# Altium schematic sheet PSU - BUCK, LDO, CHARGER.SchDoc
size A; SheetNumber: 3; SheetTotal: 3
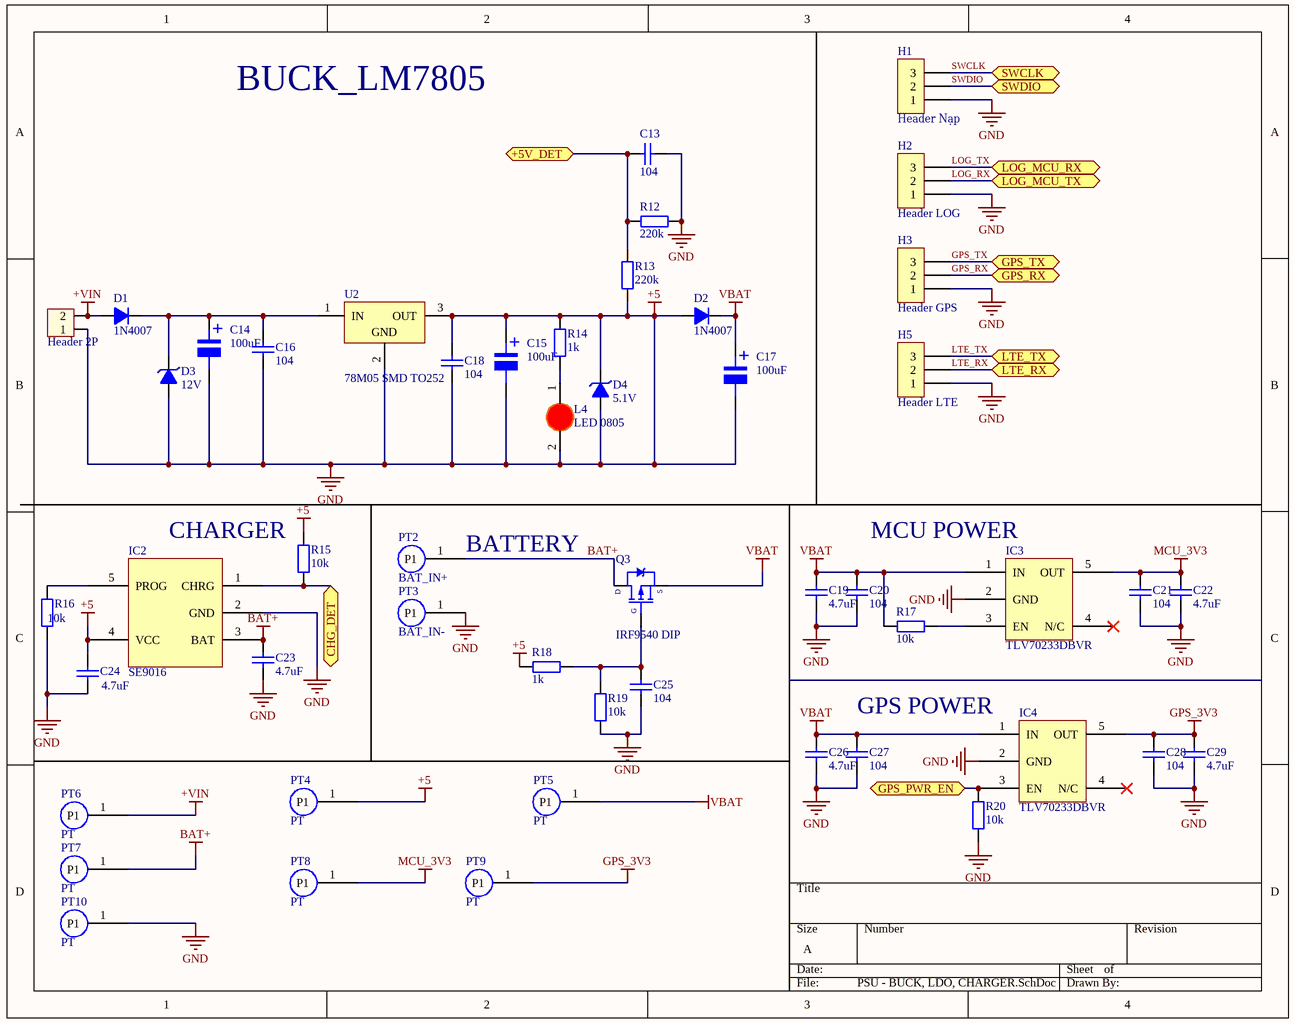
[diagram p0: PSU - BUCK, LDO, CHARGER.SchDoc]

## Parts
C13  104  [tu 0805]
C14  100uF  [tu nhom 6.3 (d)]
C15  100uF  [tu nhom 6.3 (d)]
C16  104  [tu 0805]
C17  100uF  [tu nhom 6.3 (d)]
C18  104  [tu 0805]
C19  4.7uF  [tu 0805]
C20  104  [tu 0805]
C21  104  [tu 0805]
C22  4.7uF  [tu 0805]
C23  4.7uF  [tu 0805]
C24  4.7uF  [tu 0805]
C25  104  [tu 0805]
C26  4.7uF  [tu 0805]
C27  104  [tu 0805]
C28  104  [tu 0805]
C29  4.7uF  [tu 0805]
D1  1N4007  [SODFL504X243-2N]
D2  1N4007  [SODFL504X243-2N]
D3  12V  [DIODE ZENNER SMD SOD80]
D4  5.1V  [DIODE ZENNER SMD SOD80]
H1  Header Nạp  [XH2.54M-3]
H2  Header LOG  [XH2.54M-3]
H3  Header GPS  [XH2.54M-3]
H4  Header 2P  [VH3.96M-2]
H5  Header LTE  [XH2.54M-3]
IC2  SE9016  [SOT95P280X110-5N]
IC3  TLV70233DBVR  [SOT95P280X145-5N]
IC4  TLV70233DBVR  [SOT95P280X145-5N]
L4  LED 0805  [LED-0805-Red]
PT2  BAT_IN+  [Test pont]  (no BOM)
PT3  BAT_IN-  [Test pont]  (no BOM)
PT4  PT  [Test pont]  (no BOM)
PT5  PT  [Test pont]  (no BOM)
PT6  PT  [Test pont]  (no BOM)
PT7  PT  [Test pont]  (no BOM)
PT8  PT  [Test pont]  (no BOM)
PT9  PT  [Test pont]  (no BOM)
PT10  PT  [Test pont]  (no BOM)
Q3  IRF9540 DIP  [DPAK254P1511X469-3N]
R12  220k  [tro smd 0805]
R13  220k  [tro smd 0805]
R14  1k  [tro smd 0805]
R15  10k  [tro smd 0805]
R16  10k  [tro smd 0805]
R17  10k  [tro smd 0805]
R18  1k  [tro smd 0805]
R19  10k  [tro smd 0805]
R20  10k  [tro smd 0805]
U2  78M05 SMD TO252  [TO252]

## Ports
+5V_DET (bidir), CHG_DET (bidir), GPS_PWR_EN (bidir), GPS_RX (bidir), GPS_TX (bidir), LOG_MCU_RX (bidir), LOG_MCU_TX (bidir), LTE_RX (bidir), LTE_TX (bidir), SWCLK (bidir), SWDIO (bidir)

## Nets
+5: C13.2 C14.2 C15.1 C15.2 C16.2 C17.2 C18.1 C18.2 C19.2 C20.2 C21.2 C22.2 C23.2 C24.1 C24.2 C25.2 C26.2 C27.2 C28.2 C29.2 D2.1(A) D3.1(A) D4.1(A) D4.2(K) H1.1 H2.1 H3.1 H4.1 H5.1 IC2.2(GND) IC2.4(VCC) IC3.2(GND) IC4.2(GND) L4.2(K) PT3.1(P1) PT4.1(P1) PT10.1(P1) R12.1 R13.1 R14.2 R15.2 R16.1 R18.1 R19.1 R20.1 U2.2(GND) U2.3(OUT)  [also labelled GND]
+VIN: D1.1(A) H4.2 PT6.1(P1)
BAT+: C23.1 IC2.3(BAT) PT2.1(P1) PT7.1(P1) Q3.2(D)
GPS_3V3: C28.1 C29.1 IC4.5(OUT) PT9.1(P1)
MCU_3V3: C21.1 C22.1 IC3.5(OUT) PT8.1(P1)
VBAT: C17.1 C19.1 C20.1 C26.1 C27.1 D2.2(K) IC3.1(IN) IC4.1(IN) PT5.1(P1) Q3.3(S) R17.1
+5V_DET: C13.1 R12.2 R13.2 ; port +5V_DET
CHG_DET: IC2.1(CHRG) R15.1 ; port CHG_DET
GPS_PWR_EN: IC4.3(EN) R20.2 ; port GPS_PWR_EN
GPS_RX: H3.2 ; port GPS_RX
GPS_TX: H3.3 ; port GPS_TX
LOG_RX: H2.2 ; port LOG_MCU_TX
LOG_TX: H2.3 ; port LOG_MCU_RX
LTE_RX: H5.2 ; port LTE_RX
LTE_TX: H5.3 ; port LTE_TX
SWCLK: H1.3 ; port SWCLK
SWDIO: H1.2 ; port SWDIO
NetC14_1: C14.1 C16.1 D1.2(K) D3.2(K) U2.1(IN)
NetC25_1: C25.1 Q3.1(G) R18.2 R19.2
NetIC2_5: IC2.5(PROG) R16.2
NetIC3_3: IC3.3(EN) R17.2
NetL4_1: L4.1(A) R14.1

Not connected (* = marked no-connect by the designer): IC3 4(N/C)*; IC4 4(N/C)*

## Notes on the sheet
- BUCK_LM7805
- CHARGER
- (near PT2) BATTERY
- MCU POWER
- (near C27) GPS POWER
- (in symbol Tu Nhom 100uF 25V) +

## Library data of the parts
C13 C16 C18 C20 C21 C25 C27 C28 = Tu 0805 104 50V 10%: Dán; Don_Vi: Con; So_Chan: 2; Ten_Linh_Kien: Tụ 0805 104-100nF 10% 50V; Ma_Hang: MH004551; Chung_Loai: Dán; Kieu_Chan: *
C14 C15 C17 = Tu Nhom 100uF 25V: Dán; Don_Vi: Con; So_Chan: 2; Ten_Linh_Kien: Tụ Nhôm 100uF 25V 6x7MM; Ma_Hang: MH002222; Chung_Loai: Dán; Kieu_Chan: *
C19 C22-C24 C26 C29 = Tu 0805 475 25V 20%: Dán; Don_Vi: Con; So_Chan: 2; Ten_Linh_Kien: Tụ 0805 475-4.7uF 20% 25V; Ma_Hang: MH004276; Chung_Loai: Dán; Kieu_Chan: *
D1 D2 = Diode 1N4007: Cắm; Ten_Linh_Kien: Diode 1N4007 1A (DIP); Don_Vi: Con; Ma_Hang: MH001063; Ghi Chu: *; Kieu_Chan: *; Chung_Loai: Cắm
D3 = Diode Zener 12V: Dán; Ma_Hang: MH000945; Don_Vi: Con; Ten_Linh_Kien: Diode Zener 1/2W 12V SMD1206 ZMM12; Kieu_Chan: *; Ghi_Chu: *; Chung_Loai: Dán
D4 = Diode Zener 5.1V: Dán; Ma_Hang: MH002881; Ten_Linh_Kien: Diode Zener 1/2W 5.1V SMD1206 ZMM5.1; Don_Vi: Con; Kieu_Chan: *; Ghi_Chu: *; Chung_Loai: Dán
H1-H3 H5 = Header 3P 2.54 Duc Thang: Cắm; Ten_Linh_Kien: Header 3P XH2.54-3P Đực Thẳng; Don_Vi: Con; Ma_Hang: MH001292; Chung_Loai: Cắm
H4 = Header 2P VH3.96 Duc Thang: Cắm; Ten_Linh_Kien: Header 2P XH2.54-2P Đực Thẳng; Don_Vi: Con; Ma_Hang: MH001283; Chung_Loai: Cắm
L4 = LED 0805 Do: Dán; Don_Vi: Con; Ma_Hang: MH000897; Ten_Linh_Kien: LED 0805 Màu Đỏ (Red); Ghi_Chu: *; Kieu_Chan: *; Chung_Loai: Dán
PT2-PT10 = test pont
Q3 = IRF9540 DIP: P-Channel Power MOSFET; Note: Pin 2 is electrically connected to pin 4.; Published: 8-Jun-2000; LatestRevisionDate: 17-Jul-2002; LatestRevisionNote: Re-released for DXP Platform.; DatasheetVersion: PD-9.421C; PackageVersion: Feb-1997; PackageReference: TO-220AB; Publisher: Altium Limited; PackageDescription: TO, Thru-Hole, Vertical, Heatsink Mounted; 3 In-Line Leads; Pitch 2.54 mm; ComponentLink1Description: Manufacturer Link; ComponentLink1URL: http://www.irf.com/; ComponentLink2Description: Datasheet; ComponentLink2URL: http://www.irf.com/product-info/datasheets/data/irf9540.pdf
R12 R13 = Tro 0805 5% 220k: Dán; Don_Vi: Con; So_Chan: 2; Ten_Linh_Kien: Trở 0805 5% 220k; Ma_Hang: MH005258; Chung_Loai: Dán; Kieu_Chan: *
R14 R18 = Tro 0805 1% 1k: Dán; Don_Vi: Con; So_Chan: 2; Ten_Linh_Kien: Trở 0805 1% 1k; Ma_Hang: MH005468; Chung_Loai: Dán; Kieu_Chan: *
R15-R17 R19 R20 = Tro 0805 5% 10k: Dán; Don_Vi: Con; So_Chan: 2; Ten_Linh_Kien: Trở 0805 5% 10k; Ma_Hang: MH005239; Chung_Loai: Dán; Kieu_Chan: *
U2 = 78M05 SMD TO252: Dán; Don_Vi: Con; Ten_Linh_Kien: 78M05 TO252; Ma_Hang: MH001917; Ghi_Chu: *; Kieu_Chan: *; Chung_Loai: Dán